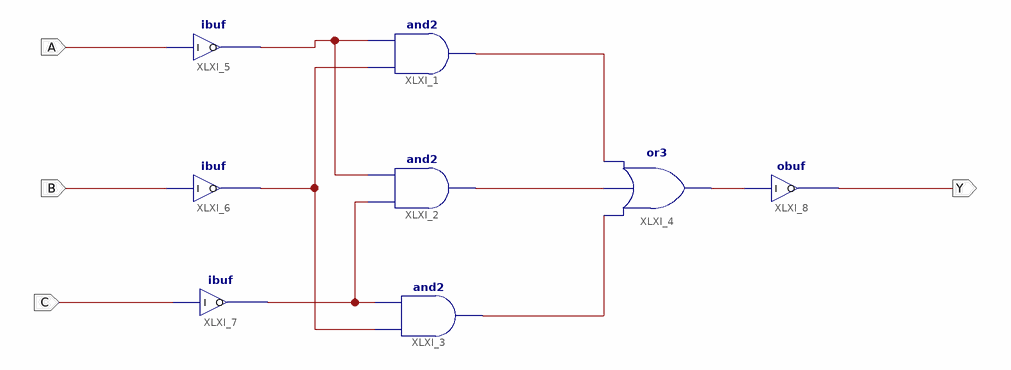
[diagram p0: schematic sheet 1]
// Xilinx ISE schematic Mayority_Detector.sch (spartan3e) as structural Verilog: 8 symbols, 4 ports
module Mayority_Detector (
  input  A,
  input  B,
  input  C,
  output Y
);

  wire XLXN_1, XLXN_2, XLXN_7, XLXN_9, XLXN_12, XLXN_13, XLXN_14;

  and XLXI_1 (XLXN_1, XLXN_9, XLXN_13);
  and XLXI_2 (XLXN_2, XLXN_12, XLXN_13);
  and XLXI_3 (XLXN_7, XLXN_9, XLXN_12);
  or XLXI_4 (XLXN_14, XLXN_7, XLXN_2, XLXN_1);
  ibuf XLXI_5 (.I(A), .O(XLXN_13));
  ibuf XLXI_6 (.I(B), .O(XLXN_9));
  ibuf XLXI_7 (.I(C), .O(XLXN_12));
  obuf XLXI_8 (.I(XLXN_14), .O(Y));

  // Notes on the sheet:
  //   LOC on signal A = K3
  //   LOC on signal B = L3
  //   LOC on signal C = P11
  //   LOC on signal Y = M5
endmodule
